# Altium project OpenBMS.PrjPcb (part 1 of 2)
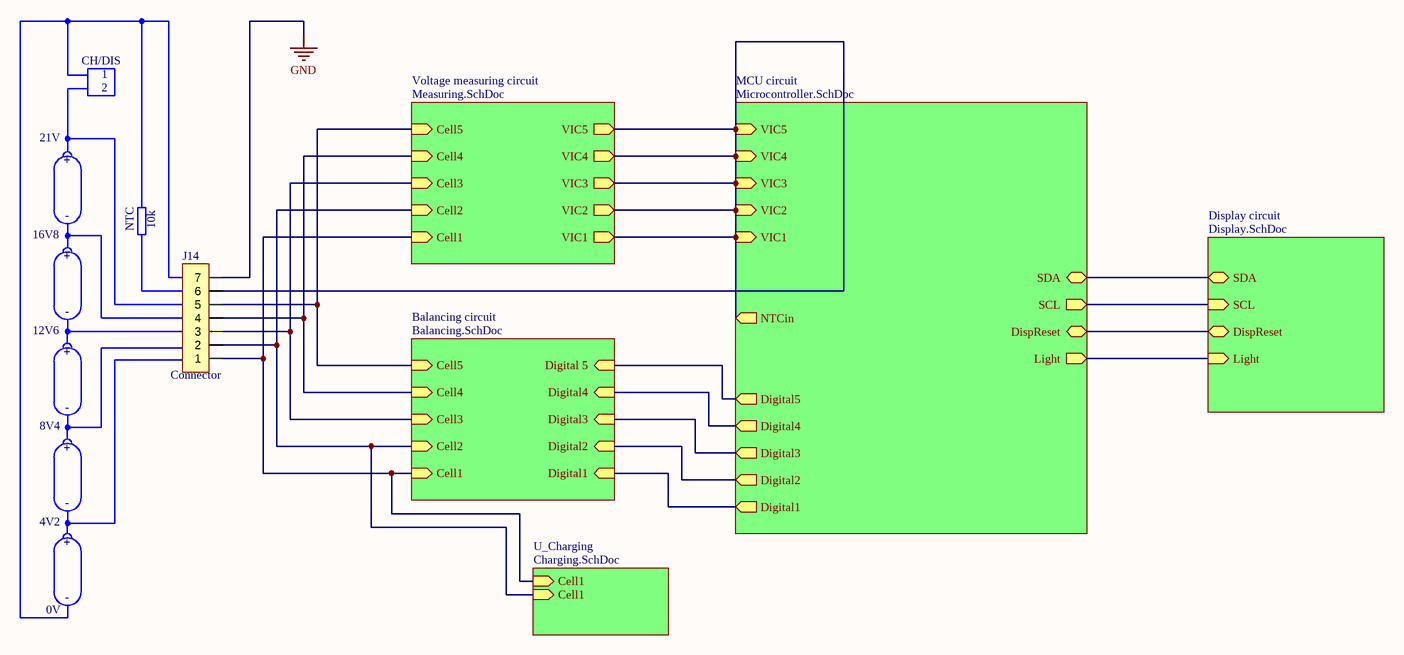
[diagram p0: OpenBMS.SchDoc]
6 sheets, 185 parts. Net scope: hierarchical (ports join the sheet entries above them; power ports are global).
Board file: OpenBMS.PcbDoc
Sheets:
  OpenBMS.SchDoc
    Balancing circuit = Balancing.SchDoc
    Voltage measuring circuit = Measuring.SchDoc
    MCU circuit = Microcontroller.SchDoc
    Display circuit = Display.SchDoc
    U_Charging = Charging.SchDoc

## Sheet OpenBMS.SchDoc: OpenBMS Parent schematic
size 420 x 297 mm; Title2: OpenBMS; Project: OpenBMS; DSN_APP_DATE: --/--/--; CHK_APP_DATE: --/--/--; ApprovedBy: 1; CheckedBy: 1; Author: Kayoum Djedidi; CompanyName: ISIMM; DrawnBy: Kayoum Djedidi; DocumentNumber: 1; Revision: 0; SheetNumber: 1; SheetTotal: 5; ImagePath: 1

### Parts
J14  Name: Connector  [HDR_1x7_2.54mm-MALE]  (hidden comment: Header connector 1x7)

### Sub-sheets
Balancing circuit = Balancing.SchDoc: Cell1 (in), Cell2 (in), Cell3 (in), Cell4 (in), Cell5 (in), Digital 5 (in), Digital4 (in), Digital3 (in), Digital2 (in), Digital1 (in)
Display circuit = Display.SchDoc: Light (in), DispReset (bidir), SCL (in), SDA (bidir)
MCU circuit = Microcontroller.SchDoc: VIC5 (in), VIC4 (in), VIC3 (in), VIC2 (in), VIC1 (in), Digital5 (out), Digital4 (out), Digital3 (out), Digital2 (out), Digital1 (out), SDA (bidir), SCL (out), DispReset (bidir), Light (out), NTCin (out)
U_Charging = Charging.SchDoc: Cell1 (in), Cell1 (in)
Voltage measuring circuit = Measuring.SchDoc: Cell5 (in), Cell4 (in), Cell3 (in), Cell2 (in), Cell1 (in), VIC5 (out), VIC4 (out), VIC3 (out), VIC2 (out), VIC1 (out)

### Nets
GND: J14.7
+21V: J14.5 ; sheet Balancing circuit/Cell5, sheet Voltage measuring circuit/Cell5
NTCin: J14.6 ; sheet Voltage measuring circuit/VIC5, sheet Voltage measuring circuit/VIC4, sheet Voltage measuring circuit/VIC3, sheet Voltage measuring circuit/VIC2, sheet Voltage measuring circuit/VIC1, sheet MCU circuit/VIC5, sheet MCU circuit/VIC4, sheet MCU circuit/VIC3, sheet MCU circuit/VIC2, sheet MCU circuit/VIC1, sheet MCU circuit/NTCin
NetC13_2: J14.1 J14.2 ; sheet Balancing circuit/Cell1, sheet Balancing circuit/Cell2, sheet Voltage measuring circuit/Cell2, sheet Voltage measuring circuit/Cell1, sheet U_Charging/Cell1, sheet U_Charging/Cell1
NetDS1_1: sheet MCU circuit/DispReset, sheet Display circuit/DispReset
NetDS1_2: sheet MCU circuit/SCL, sheet Display circuit/SCL
NetDS1_3: sheet MCU circuit/SDA, sheet Display circuit/SDA
NetJ3_1: J14.3 ; sheet Balancing circuit/Cell3, sheet Voltage measuring circuit/Cell3
NetJ4_1: J14.4 ; sheet Balancing circuit/Cell4, sheet Voltage measuring circuit/Cell4
NetMCU1_5: sheet Balancing circuit/Digital 5, sheet MCU circuit/Digital5
NetMCU1_6: sheet Balancing circuit/Digital4, sheet MCU circuit/Digital4
NetMCU1_7: sheet Balancing circuit/Digital3, sheet MCU circuit/Digital3
NetMCU1_8: sheet Balancing circuit/Digital2, sheet MCU circuit/Digital2
NetMCU1_9: sheet Balancing circuit/Digital1, sheet MCU circuit/Digital1
NetMCU1_13: sheet MCU circuit/Light, sheet Display circuit/Light

### Notes on the sheet
- CH/DIS
- 1
- 21V
- 2
- +
- -
- 16V8
- NTC
- 10k
- 12V6
- 8V4
- 4V2
- 0V
- THIS DOCUMENT AND THE DATA DISCLOSED HEREIN OR
- HEREWITH IS THE PROPERTY OF ALTIUM LIMITED AND MAY
- DWG NO:
- REVISION
- REV:
- DESCRIPTION
- DATE
- APPROVED
- BE FREELY DISTRIBUTED IN WHOLE. NO RIGHTS ARE
- RESERVED OR EXPRESS OR IMPLIED WARANTEE GIVEN.
- ENG:
- APPROVALS
- PROJECT
- DSN:
- CHK:
- REFERENCE DOCUMENTS
- PROJECT REVISION:
- TITLE
- DOCUMENT REVISION:
- DESIGN ITEM:
- BOM:
- FAB DWG:
- PCB DWG:
- ASSY DWG:
- SCALE:
- A3
- SIZE
- CAGE CODE
- FILE NAME
- DWG NO.
- SHEET
- OF
- REV

### Library data of the parts
J14 = Header connector 1x7: Header, 7-Pin [TH]; Manufacturer: Molex; Manufacturer Part Number: 70543-0006; Contact Resistance: 30mR; Current Rating: 3A; Gender: Male; Glow Wire Compliant: Non-compliant; Number of Circuits: 7; Pitch: 2.54mm; Voltage Rating: 250V; LatestRevisionDate: 17-Jul-2002; LatestRevisionNote: Re-released for DXP Platform.; Publisher: Altium Limited; ComponentLink1Description: Male_DATASHEET; ComponentLink1URL: https://hr.mouser.com/datasheet/2/276/1/0705430006_PCB_HEADERS-172671.pdf; ComponentLink2Description: Male_BUY; ComponentLink2URL: https://hr.mouser.com/ProductDetail/Molex/70543-0006?qs=tYx%252BZc2nXqqLGOznLgFBUw%3D%3D; ComponentLink3Description: Female_DATASHEET; ComponentLink3URL: https://hr.mouser.com/datasheet/2/276/0014600072_RB_CBL_WR_TRP_CONN-157136.pdf; ComponentLink4Description: Female_BUY; ComponentLink4URL: https://hr.mouser.com/ProductDetail/Molex/14-60-0072?qs=NB3s7TNnM%252BbcvQdqxWlaYA%3D%3D; Supplier 1: Mouser; Supplier Part Number 1: 538-70543-0006; Color: Black; Contact Material: Bronze,Copper Alloy; Contact Plating: Gold; ELV: Compliant; Flammability Rating: UL94 V-0; Housing Color: Black; Housing Material: Thermoplastic; Lead Free: Lead Free; Material: Brass; Max Operating Temperature: 105°C; Min Operating Temperature: -40°C; Mount: Through Hole; Number of Contacts: 7; Number of Positions: 7; Number of Rows: 1; Orientation: Vertical; Package Quantity: 1248; Packaging: Rail/Tube; Radiation Hardening: No; REACH SVHC: Unknown; RoHS Compliant: Yes; Series: 70543; Termination: Through Hole; Supplier Packaging 1: Tube; Supplier Unit Price 1: $1.68; Supplier Location 1: US

## Sheet Balancing.SchDoc: Cell Balancing
size 420 x 297 mm; ENG_APP_DATE: --/--/--; DSN_APP_DATE: --/--/--; CHK_APP_DATE: --/--/--
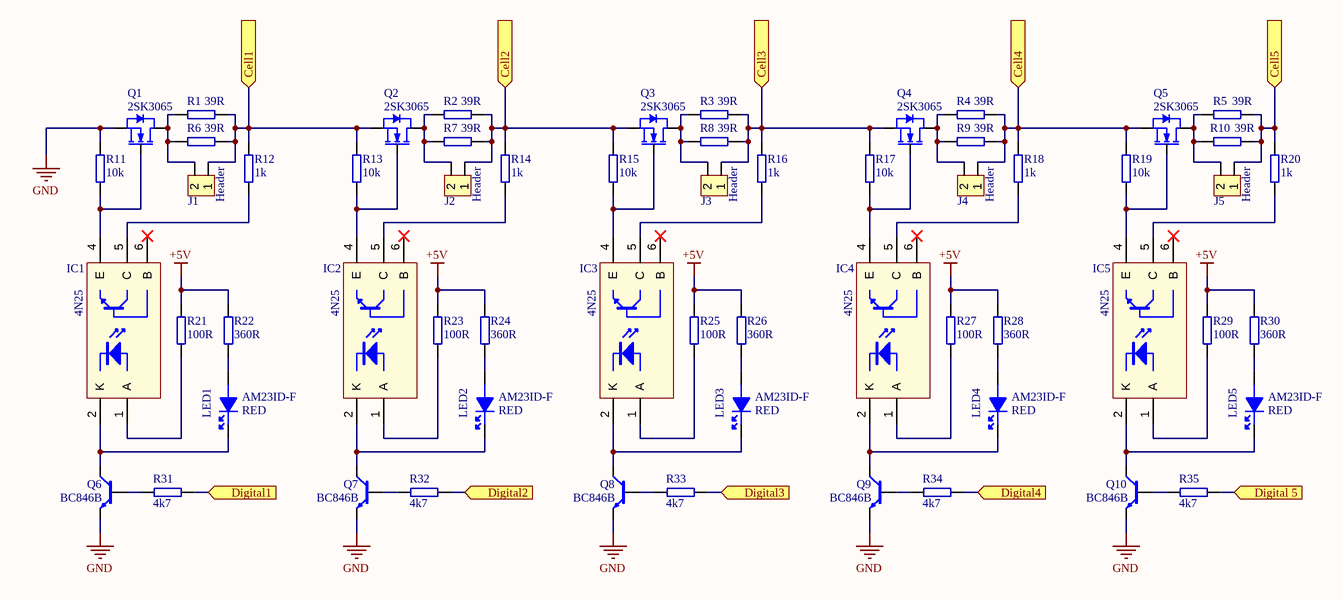
[diagram p1: Balancing.SchDoc]

### Parts
IC1  Manufacturer Part Number: 4N25  [DIP6]  (hidden comment: 4N25_DIP6)
IC2  Manufacturer Part Number: 4N25  [DIP6]  (hidden comment: 4N25_DIP6)
IC3  Manufacturer Part Number: 4N25  [DIP6]  (hidden comment: 4N25_DIP6)
IC4  Manufacturer Part Number: 4N25  [DIP6]  (hidden comment: 4N25_DIP6)
IC5  Manufacturer Part Number: 4N25  [DIP6]  (hidden comment: 4N25_DIP6)
J1  Name: Header  [HDR_1x2_2.54mm-MALE]  (hidden comment: 2.54mm pitch)
J2  Name: Header  [HDR_1x2_2.54mm-MALE]  (hidden comment: 2.54mm pitch)
J3  Name: Header  [HDR_1x2_2.54mm-MALE]  (hidden comment: 2.54mm pitch)
J4  Name: Header  [HDR_1x2_2.54mm-MALE]  (hidden comment: 2.54mm pitch)
J5  Name: Header  [HDR_1x2_2.54mm-MALE]  (hidden comment: 2.54mm pitch)
LED1  Name: RED  Manufacturer Part Number: AM23ID-F  [LED_SOT23]  (hidden comment: LED_SOT23)
LED2  Name: RED  Manufacturer Part Number: AM23ID-F  [LED_SOT23]  (hidden comment: LED_SOT23)
LED3  Name: RED  Manufacturer Part Number: AM23ID-F  [LED_SOT23]  (hidden comment: LED_SOT23)
LED4  Name: RED  Manufacturer Part Number: AM23ID-F  [LED_SOT23]  (hidden comment: LED_SOT23)
LED5  Name: RED  Manufacturer Part Number: AM23ID-F  [LED_SOT23]  (hidden comment: LED_SOT23)
Q1  Name: 2SK3065  [N_MOSFET]  (hidden comment: 2SK3065_SOT89)
Q2  Name: 2SK3065  [N_MOSFET]  (hidden comment: 2SK3065_SOT89)
Q3  Name: 2SK3065  [N_MOSFET]  (hidden comment: 2SK3065_SOT89)
Q4  Name: 2SK3065  [N_MOSFET]  (hidden comment: 2SK3065_SOT89)
Q5  Name: 2SK3065  [N_MOSFET]  (hidden comment: 2SK3065_SOT89)
Q6  Name: BC846B  [NPN_BJT_SOT23]  (hidden comment: BC846B_SOT23)
Q7  Name: BC846B  [NPN_BJT_SOT23]  (hidden comment: BC846B_SOT23)
Q8  Name: BC846B  [NPN_BJT_SOT23]  (hidden comment: BC846B_SOT23)
Q9  Name: BC846B  [NPN_BJT_SOT23]  (hidden comment: BC846B_SOT23)
Q10  Name: BC846B  [NPN_BJT_SOT23]  (hidden comment: BC846B_SOT23)
R1  Name: 39R  [R_2512]  (hidden comment: 39R_2W)
R2  Name: 39R  [R_2512]  (hidden comment: 39R_2W)
R3  Name: 39R  [R_2512]  (hidden comment: 39R_2W)
R4  Name: 39R  [R_2512]  (hidden comment: 39R_2W)
R5  Name: 39R  [R_2512]  (hidden comment: 39R_2W)
R6  Name: 39R  [R_2512]  (hidden comment: 39R_2W)
R7  Name: 39R  [R_2512]  (hidden comment: 39R_2W)
R8  Name: 39R  [R_2512]  (hidden comment: 39R_2W)
R9  Name: 39R  [R_2512]  (hidden comment: 39R_2W)
R10  Name: 39R  [R_2512]  (hidden comment: 39R_2W)
R11  Name: 10k  [R_0805]  (hidden comment: 10k_125mW)
R12  Name: 1k  [R_0805]  (hidden comment: 1k_125mW)
R13  Name: 10k  [R_0805]  (hidden comment: 10k_125mW)
R14  Name: 1k  [R_0805]  (hidden comment: 1k_125mW)
R15  Name: 10k  [R_0805]  (hidden comment: 10k_125mW)
R16  Name: 1k  [R_0805]  (hidden comment: 1k_125mW)
R17  Name: 10k  [R_0805]  (hidden comment: 10k_125mW)
R18  Name: 1k  [R_0805]  (hidden comment: 1k_125mW)
R19  Name: 10k  [R_0805]  (hidden comment: 10k_125mW)
R20  Name: 1k  [R_0805]  (hidden comment: 1k_125mW)
R21  Name: 100R  [R_0805]  (hidden comment: 100R_500mW)
R22  Name: 360R  [R_0805]  (hidden comment: 360R_125mW)
R23  Name: 100R  [R_0805]  (hidden comment: 100R_500mW)
R24  Name: 360R  [R_0805]  (hidden comment: 360R_125mW)
R25  Name: 100R  [R_0805]  (hidden comment: 100R_500mW)
R26  Name: 360R  [R_0805]  (hidden comment: 360R_125mW)
R27  Name: 100R  [R_0805]  (hidden comment: 100R_500mW)
R28  Name: 360R  [R_0805]  (hidden comment: 360R_125mW)
R29  Name: 100R  [R_0805]  (hidden comment: 100R_500mW)
R30  Name: 360R  [R_0805]  (hidden comment: 360R_125mW)
R31  Name: 4k7  [R_0805]  (hidden comment: 4k7_125mW)
R32  Name: 4k7  [R_0805]  (hidden comment: 4k7_125mW)
R33  Name: 4k7  [R_0805]  (hidden comment: 4k7_125mW)
R34  Name: 4k7  [R_0805]  (hidden comment: 4k7_125mW)
R35  Name: 4k7  [R_0805]  (hidden comment: 4k7_125mW)

### Ports
Cell1 (in), Cell2 (in), Cell3 (in), Cell4 (in), Cell5 (in), Digital1 (in), Digital2 (in), Digital3 (in), Digital4 (in), Digital 5 (in)

### Nets
+5V: R21.2 R22.1 R23.1 R24.1 R25.1 R26.1 R27.1 R28.1 R29.1 R30.1
GND: Q1.3(S) Q6.3(E) Q7.3(E) Q8.3(E) Q9.3(E) Q10.3(E) R11.1
+21V: J5.1 R5.1 R10.1 R20.1 ; port Cell5
NetC13_2: J1.1 J2.1 Q2.3(S) Q3.3(S) R1.1 R2.1 R6.1 R7.1 R12.1 R13.1 R14.1 R15.1 ; port Cell1, port Cell2
NetIC1_1: IC1.1(A) R21.1
NetIC1_2: IC1.2(K) LED1.3(K) Q6.1(C)
NetIC1_4: IC1.4(E) Q1.1(G) R11.2
NetIC1_5: IC1.5(C) R12.2
NetIC2_1: IC2.1(A) R23.2
NetIC2_2: IC2.2(K) LED2.3(K) Q7.1(C)
NetIC2_4: IC2.4(E) Q2.1(G) R13.2
NetIC2_5: IC2.5(C) R14.2
NetIC3_1: IC3.1(A) R25.2
NetIC3_2: IC3.2(K) LED3.3(K) Q8.1(C)
NetIC3_4: IC3.4(E) Q3.1(G) R15.2
NetIC3_5: IC3.5(C) R16.2
NetIC4_1: IC4.1(A) R27.2
NetIC4_2: IC4.2(K) LED4.3(K) Q9.1(C)
NetIC4_4: IC4.4(E) Q4.1(G) R17.2
NetIC4_5: IC4.5(C) R18.2
NetIC5_1: IC5.1(A) R29.2
NetIC5_2: IC5.2(K) LED5.3(K) Q10.1(C)
NetIC5_4: IC5.4(E) Q5.1(G) R19.2
NetIC5_5: IC5.5(C) R20.2
NetJ1_2: J1.2 Q1.2(D) R1.2 R6.2
NetJ2_2: J2.2 Q2.2(D) R2.2 R7.2
NetJ3_1: J3.1 Q4.3(S) R3.1 R8.1 R16.1 R17.1 ; port Cell3
NetJ3_2: J3.2 Q3.2(D) R3.2 R8.2
NetJ4_1: J4.1 Q5.3(S) R4.1 R9.1 R18.1 R19.1 ; port Cell4
NetJ4_2: J4.2 Q4.2(D) R4.2 R9.2
NetJ5_2: J5.2 Q5.2(D) R5.2 R10.2
NetLED1_1: LED1.1(A) R22.2
NetLED2_1: LED2.1(A) R24.2
NetLED3_1: LED3.1(A) R26.2
NetLED4_1: LED4.1(A) R28.2
NetLED5_1: LED5.1(A) R30.2
NetMCU1_5: R35.2 ; port Digital 5
NetMCU1_6: R34.1 ; port Digital4
NetMCU1_7: R33.2 ; port Digital3
NetMCU1_8: R32.1 ; port Digital2
NetMCU1_9: R31.1 ; port Digital1
NetQ6_2: Q6.2(B) R31.2
NetQ7_2: Q7.2(B) R32.2
NetQ8_2: Q8.2(B) R33.1
NetQ9_2: Q9.2(B) R34.2
NetQ10_2: Q10.2(B) R35.1

Not connected (* = marked no-connect by the designer): IC1 6(B)*; IC2 6(B)*; IC3 6(B)*; IC4 6(B)*; IC5 6(B)*

### Notes on the sheet
- THIS DOCUMENT AND THE DATA DISCLOSED HEREIN OR
- HEREWITH IS THE PROPERTY OF ALTIUM LIMITED AND MAY
- DWG NO:
- REVISION
- REV:
- DESCRIPTION
- DATE
- APPROVED
- BE FREELY DISTRIBUTED IN WHOLE. NO RIGHTS ARE
- RESERVED OR EXPRESS OR IMPLIED WARANTEE GIVEN.
- ENG:
- APPROVALS
- PROJECT
- DSN:
- CHK:
- REFERENCE DOCUMENTS
- PROJECT REVISION:
- TITLE
- DOCUMENT REVISION:
- DESIGN ITEM:
- BOM:
- FAB DWG:
- PCB DWG:
- ASSY DWG:
- SCALE:
- A3
- SIZE
- CAGE CODE
- FILE NAME
- DWG NO.
- SHEET
- OF
- REV

### Library data of the parts
IC1-IC5 = 4N25_DIP6: Optocoupler [TH]; Manufacturer: Vishay Semiconductors; Max Power Dissipation: 150mW; Number of Elements: 1; Collector Emitter Voltage (VCEO): 30V; Rise Time: 2s; Isolation Voltage: 5kV; Forward Voltage: 1.5V; Forward Current: 60mA; Collector Emitter Saturation Voltage: 500mV; Reverse Breakdown Voltage: 5V; Output Voltage: 70V; Output Current per Channel: 50mA; Max Collector Current: 100mA; Current Transfer Ratio: 50%; Approvals: UL; Supplier 1: Mouser; RoHS: Yes; Mount: Through Hole; Case/Package: DIP-6; Number of Pins: 6; Contact Plating: Tin; Min Operating Temperature: -55°C; Max Operating Temperature: 100°C; Packaging: Rail/Tube; Package Quantity: 2000; Power Dissipation: 150mW; Number of Channels: 1; Max Input Current: 60mA; Max Output Voltage: 30V; Fall Time: 2s; Input Current: 50mA; Collector Emitter Breakdown Voltage: 30V; Radiation Hardening: No; Lead Free: Lead Free; REACH SVHC: Unknown; ComponentLink1URL: https://hr.mouser.com/datasheet/2/427/VISHS81804_1-2566401.pdf; ComponentLink1Description: DATASHEET; ComponentLink3URL: https://hr.mouser.com/ProductDetail/Vishay-Semiconductors/4N25?qs=8Ee2Dc0%2F0IdkAlKrFkNMCA%3D%3D; ComponentLink3Description: BUY; Supplier Part Number 1: 78-4N25
J1-J5 = Header 1x2: Header, 2-Pin [TH]; Manufacturer: Molex; Current Rating: 4A; Gender: Male; Glow Wire Compliant: Non-compliant; Number of Circuits: 15; Pitch: 0.1inch; Voltage Rating: 250V; Connector Type: Male Pin; LatestRevisionDate: 17-Jul-2002; LatestRevisionNote: Re-released for DXP Platform.; Publisher: Altium Limited; ComponentLink1Description: DATASHEET; ComponentLink1URL: https://hr.mouser.com/datasheet/2/276/0022284150_PCB_HEADERS-159054.pdf; ComponentLink2Description: BUY; ComponentLink2URL: https://hr.mouser.com/ProductDetail/Molex/22-28-4150?qs=M5Ic86%252BuP8aClMFgmZrq7g%3D%3D; Supplier 1: Mouser; Supplier Part Number 1: 538-22-28-4150; Color: Black; Contact Material: Brass; Contact Mating Length: 0.24inch; Contact Plating: Tin; Contact Type: Male Pin; Flammability Rating: UL94 V-0; Height: 2.29mm; Housing Color: Black; Housing Material: Thermoplastic; Lead Free: Contains Lead; Length: 38.1mm; Mount: Through Hole; Number of Contacts: 15; Number of Positions: 15; Number of Rows: 1; Orientation: Vertical; Package Quantity: 1; Packaging: Bulk; RoHS Compliant: Yes; Series: KK® 42375; Termination: Solder; Voltage Rating (DC): 250V; Width: 2.49mm; Supplier Packaging 1: Bulk; Supplier Unit Price 1: $0.57; Supplier Location 1: US; Manufacturer Part Number: 22-28-4150
LED1-LED5 = LED_SOT23: Red LED [SMD]; Manufacturer: Kingbright; Dominant Wavelength: 617nm; Forward Current: 20mA; Forward Voltage: 2V; Lens Style: Diffused,Tinted; Lens Transparency: Diffused; Luminous Intensity: 7mcd; Power Rating: 75mW; Viewing Angle: 140°; Wavelength: 625nm; ComponentLink1Description: DATASHEET; ComponentLink1URL: https://hr.mouser.com/datasheet/2/216/AM23ID-F-33364.pdf; ComponentLink2Description: BUY; ComponentLink2URL: https://hr.mouser.com/ProductDetail/Kingbright/AM23ID-F?qs=y3UkhjaxUTbVf8YFp%2FiekA%3D%3D; Supplier 1: Mouser; Supplier Part Number 1: 604-AM23ID-F; Case/Package: SOT-23; Color: Red; Height: 1.2mm; Illumination Color: Red; Lead Free: Lead Free; Length: 3mm; Lens Color: Red; Max Operating Temperature: 85°C; Min Operating Temperature: -40°C; Mount: Surface Mount; Package Quantity: 2000; Packaging: Tape and Reel; RoHS Compliant: Yes; Series: -; Test Current: 20mA; Width: 1.3mm; Supplier Packaging 1: Tape & Reel; Supplier Unit Price 1: $0.50; Supplier Location 1: US
Q1-Q5 = 2SK3065_SOT89: N Channel MOSFET [SMD]; Manufacturer_Part_Number: 2SK3065T100; Manufacturer: Rohm; Vendor: ROHM Semiconductor; Built_By: EMA_Matt; SourceLibrary: Rohm_2019-09-23; Type: DEV; Continuous Drain Current (ID): 2A; Drain to Source Breakdown Voltage: 60V; Drain to Source Resistance: 350mR; Element Configuration: Single; Fall Time: 70ns; Gate to Source Voltage (Vgs): 20V; Input Capacitance: 160pF; Max Power Dissipation: 500mW; Nominal Vgs: 800mV; On-State Resistance: 450mR; Power Dissipation: 2W; Rds On Max: 320mR; Rise Time: 50ns; Turn-Off Delay Time: 120ns; Turn-On Delay Time: 20ns; Copyright: Copyright (C) 2018 Accelerated Designs. All rights reserved; RefDes: RefDes; Value: Value; ComponentLink1Description: DATASHEET; ComponentLink1URL: https://hr.mouser.com/datasheet/2/348/rohm_semiconductor_rohms30086-1-1742632.pdf; ComponentLink2Description: BUY; ComponentLink2URL: https://hr.mouser.com/ProductDetail/ROHM-Semiconductor/2SK3065T100?qs=4kLU8WoGk0uDb4MT5MWZbg%3D%3D; Supplier 1: Mouser; Supplier Part Number 1: 755-2SK3065T100; Case/Package: SOT-89; Current Rating: 2A; Drain to Source Voltage (Vdss): 60V; Lead Free: Lead Free; Max Operating Temperature: 150°C; Min Operating Temperature: -55°C; Mount: Surface Mount; Number of Pins: 3; Package Quantity: 1000; Packaging: Tape and Reel; Radiation Hardening: No; REACH SVHC: No SVHC; RoHS Compliant: Yes; Threshold Voltage: 800mV; Voltage Rating (DC): 60V; Supplier Packaging 1: Tape & Reel; Supplier Unit Price 1: $0.68; Supplier Location 1: US; Manufacturer Part Number: 2SK3065T100
Q6-Q10 = BC846B_SOT23: NPN transistor [SMD]; Manufacturer Part Number: BC846ALT1G; Manufacturer: ON Semiconductor; Collector Base Voltage (VCBO): 80V; Collector Emitter Breakdown Voltage: 65V; Collector Emitter Saturation Voltage: 600mV; Current Rating: 100mA; Element Configuration: Single; Emitter Base Voltage (VEBO): 6V; Frequency: 100MHz; hFE Min: 110; Max Power Dissipation: 300mW; Number of Elements: 1; ComponentLink1Description: DATASHEET; ComponentLink1URL: https://hr.mouser.com/datasheet/2/308/1/BC846ALT1_D-2310268.pdf; ComponentLink2Description: BUY; ComponentLink2URL: https://hr.mouser.com/ProductDetail/onsemi/BC846ALT1G?qs=vNc2DXHODiKaYXYnVvJi5w%3D%3D; Case/Package: SOT-23; Collector Emitter Voltage (VCEO): 65V; Collector-emitter Voltage-Max: 600mV; Contact Plating: Tin,Matte; Gain Bandwidth Product: 100MHz; Halogen Free: Halogen Free; Height: 0.94mm; Lead Free: Lead Free; Length: 2.9mm; Max Breakdown Voltage: 65V; Max Collector Current: 100mA; Max Frequency: 100MHz; Max Operating Temperature: 150°C; Min Operating Temperature: -55°C; Number of Pins: 3; Package Quantity: 1; Packaging: Tape and Reel; Polarity: NPN; Power Dissipation: 300mW; Radiation Hardening: No; REACH SVHC: No SVHC; RoHS Compliant: Yes; Series: BC846AL; Transition Frequency: 100MHz; Voltage Rating (DC): 65V; Width: 1.3mm; Supplier 1: Mouser; Supplier Part Number 1: 863-BC846ALT1G
R1-R10 = R_39R_2512: Resistor [SMD]; Manufacturer: TE Connectivity; Manufacturer Part Number: CRGP2512F39R; Max Power Dissipation: 2W; Temperature Coefficient: 200ppm/°C; Tolerance: 1%; ComponentLink1Description: DATASHEET; ComponentLink1URL: https://hr.mouser.com/datasheet/2/418/8/ENG_DS_9_1773463_9_B-1358566.pdf; ComponentLink2Description: BUY; ComponentLink2URL: https://hr.mouser.com/ProductDetail/TE-Connectivity-Holsworthy/CRGP2512F39R?qs=sGAEpiMZZMtlubZbdhIBIOInyB5Ysv8sHnBniE7kULc%3D; Supplier 1: Mouser; Supplier Part Number 1: 279-CRGP2512F39R; Case/Package: 2512; Max Operating Temperature: 155°C; Min Operating Temperature: -55°C; Number of Terminations: 2; Packaging: Cut Tape; Resistance: 39R; Resistor Type: Thick Film; RoHS Compliant: Yes; Supplier Unit Price 1: $0.57; Supplier Location 1: US
R11 R13 R15 R17 R19 = R_10k_0805: Resistor [SMD]; Manufacturer: Vishay; Manufacturer Part Number: CRCW080510K0FKEAC; Power Rating: 125mW; Resistance: 10000R; Tolerance: 1%; ComponentLink1Description: DATASHEET; ComponentLink1URL: https://hr.mouser.com/datasheet/2/427/crcwce3-1762584.pdf; ComponentLink2Description: BUY; ComponentLink2URL: https://hr.mouser.com/ProductDetail/Vishay-Dale/CRCW080510K0FKEAC?qs=E3Y5ESvWgWORadmUijPtxQ%3D%3D; Supplier 1: Mouser; Supplier Part Number 1: 71-CRCW080510K0FKEAC; Case/Package: 0805; Lead Free: Lead Free; RoHS Compliant: Yes; Supplier Packaging 1: Tape & Reel; Supplier Unit Price 1: $0.10; Supplier Location 1: US
R12 R14 R16 R18 R20 = R_1k_0805: Resistor [SMD]; Manufacturer: Vishay; Manufacturer Part Number: CRCW08051K00FKEAC; Max Power Dissipation: 125mW; Resistance: 1kR; Temperature Coefficient: 100ppm/°C; Tolerance: 1%; Voltage Rating: 150V; ComponentLink1Description: DATASHEET; ComponentLink1URL: https://www.mouser.com/datasheet/2/427/crcwce3-1762584.pdf; ComponentLink2Description: BUY; ComponentLink2URL: https://www.mouser.com/ProductDetail/Vishay-Dale/CRCW08051K00FKEAC?qs=CZ6xfwOSLTXmQIgaYvN%2FBA%3D%3D; Supplier 1: Mouser; Supplier Part Number 1: 71-CRCW08051K00FKEAC; Case Code (Imperial): 0805; Case Code (Metric): 2012; Case/Package: 0805; Contact Plating: Tin; Features: Automotive AEC-Q200,Anti-Sulfur; Height: 0.02inch; Length: 2mm; Max Operating Temperature: 155°C; Min Operating Temperature: -55°C; Number of Terminations: 2; Package Quantity: 5000; Packaging: Tape and Reel; Power Rating: 125mW; Radiation Hardening: No; Resistor Type: Thick Film; RoHS Compliant: Yes; Series: RCA; Termination: Wraparound; Width: 0.049inch; Supplier Packaging 1: Tape & Reel; Supplier Unit Price 1: $0.12; Supplier Location 1: US; Lead Free: Lead Free; Mount: Surface Mount
R21 R23 R25 R27 R29 = R_100R_0805: Resistor [SMD]; Manufacturer: Vishay Dale; Manufacturer Part Number: CRCW0805100RFKEAHP; Max Power Dissipation: 500mW; Power Rating: 330mW; Resistance Tolerance: 1%; Temperature Coefficient: 100ppm/°C; Voltage Rating: 150V; ComponentLink1Description: DATASHEET; ComponentLink1URL: https://hr.mouser.com/datasheet/2/427/crcwhpe3-1713858.pdf; ComponentLink2Description: BUY; ComponentLink2URL: https://hr.mouser.com/ProductDetail/Vishay-Dale/CRCW0805100RFKEAHP?qs=sGAEpiMZZMtlubZbdhIBIB2QTI7Ai3WqiihO7cZ%2FwYw%3D; Supplier 1: Mouser; Supplier Part Number 1: 71-CRCW0805100RFKEAH; Case Code (Imperial): 0805; Case Code (Metric): 2012; Case/Package: 0805; Construction: Rectangular; Contact Plating: Tin; Depth: 1.25mm; Features: Automotive AEC-Q200; Height: 0.5mm; Lead Free: Lead Free; Length: 2mm; Max Operating Temperature: 155°C; Military Standard: Not; Min Operating Temperature: -55°C; Mount: Surface Mount; Number of Terminations: 2; Package Quantity: 5000; Packaging: Tape and Reel; Radiation Hardening: No; REACH SVHC: Unknown; Resistance: 100R; Resistor Type: Thick Film; RoHS Compliant: Yes; Series: CRCW-HP; Technology: THICK FILM; Termination: SMD/SMT; Tolerance: 1%; Voltage Rating (DC): 150V; Weight: 0.000194oz; Width: 1.2mm
R22 R24 R26 R28 R30 = R_360R_0805: Resistor [SMD]; Manufacturer: Vishay; Manufacturer Part Number: CRCW0805360RFKEA; Max Power Dissipation: 125mW; Number of Terminals/Pins: 2; Temperature Coefficient: 100ppm/°C; Tolerance: 1%; Voltage Rating: 150V; ComponentLink1Description: DATASHEET; ComponentLink1URL: https://hr.mouser.com/datasheet/2/427/dcrcwe3-1762152.pdf; ComponentLink2Description: BUY; ComponentLink2URL: https://hr.mouser.com/ProductDetail/Vishay-Dale/CRCW0805360RFKEA?qs=ofC1ORbyWJdnf1jRDhIDIw%3D%3D; Supplier 1: Mouser; Supplier Part Number 1: 71-CRCW0805360RFKEA; Case Code (Imperial): 0805; Case Code (Metric): 2012; Case/Package: 0805; Contact Plating: Tin; Depth: 1.25mm; Features: Automotive AEC-Q200; Height: 0.45mm; Lead Free: Lead Free; Length: 2mm; Max Operating Temperature: 155°C; Military Standard: Not; Min Operating Temperature: -55°C; Number of Pins: 2; Number of Terminations: 2; Package Quantity: 5000; Packaging: Cut Tape; Power Rating: 125mW; Radiation Hardening: No; REACH SVHC: Unknown; Resistance: 360R; Resistor Type: Thick Film; RoHS Compliant: Yes; Series: D/CRCW E3; Technology: THICK FILM; Termination: SMD/SMT; Voltage Rating (DC): 150V; Weight: 0.000194oz; Width: 1.25mm; Supplier Packaging 1: Tape & Reel; Supplier Unit Price 1: $0.12; Supplier Location 1: US
R31-R35 = R_4k7_0805: Resistor [SMD]; Manufacturer: Vishay; Manufacturer Part Number: CRCW08054K70FKEAC; Power Rating: 125mW; Resistance: 4.7kR; Tolerance: 1%; Temperature Coefficient: 100ppm/°C; ComponentLink1Description: DATASHEET; ComponentLink1URL: https://www.mouser.com/datasheet/2/427/crcwce3-1762584.pdf; ComponentLink2Description: BUY; ComponentLink2URL: https://www.mouser.com/ProductDetail/Vishay-Dale/CRCW08054K70FKEAC?qs=E3Y5ESvWgWOQAAVugewEHA%3D%3D; Case/Package: 0805; Lead Free: Lead Free; RoHS Compliant: Yes; Contact Plating: Tin; Length: 2mm; Max Operating Temperature: 155°C; Min Operating Temperature: -55°C; Mount: Surface Mount; Resistor Type: Thick Film; Termination: Wraparound; Supplier Part Number 1: 71-CRCW08054K70FKEAC; Supplier 1: Mouser

## Sheet Measuring.SchDoc: Voltage Measurer
size 420 x 297 mm; ENG_APP_DATE: --/--/--; DSN_APP_DATE: --/--/--; CHK_APP_DATE: --/--/--; Revision: Cell Balancing
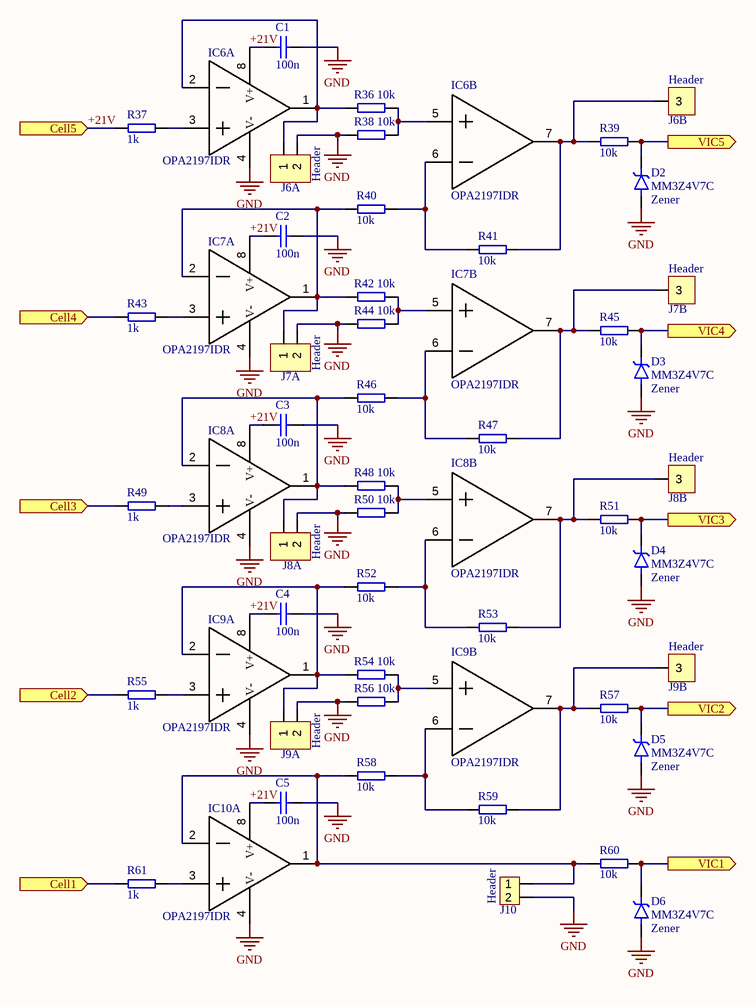
[diagram p2: Measuring.SchDoc]

### Parts
C1  Name: 100n  [C_0805]  (hidden comment: 100nF_35V)
C2  Name: 100n  [C_0805]  (hidden comment: 100nF_35V)
C3  Name: 100n  [C_0805]  (hidden comment: 100nF_35V)
C4  Name: 100n  [C_0805]  (hidden comment: 100nF_35V)
C5  Name: 100n  [C_0805]  (hidden comment: 100nF_35V)
D2  value MM3Z4V7C  Type: Zener  [SODFL2512X90N]  (hidden comment: MM3Z4V7C_SOD-323F)
D3  value MM3Z4V7C  Type: Zener  [SODFL2512X90N]  (hidden comment: MM3Z4V7C_SOD-323F)
D4  value MM3Z4V7C  Type: Zener  [SODFL2512X90N]  (hidden comment: MM3Z4V7C_SOD-323F)
D5  value MM3Z4V7C  Type: Zener  [SODFL2512X90N]  (hidden comment: MM3Z4V7C_SOD-323F)
D6  value MM3Z4V7C  Type: Zener  [SODFL2512X90N]  (hidden comment: MM3Z4V7C_SOD-323F)
IC6  Manufacturer_Part_Number: OPA2197IDR  [SOIC8]  (hidden comment: OPA2197IDR_8-SOIC)  (parts A,B of 2)
IC7  Manufacturer_Part_Number: OPA2197IDR  [SOIC8]  (hidden comment: OPA2197IDR_8-SOIC)  (parts A,B of 2)
IC8  Manufacturer_Part_Number: OPA2197IDR  [SOIC8]  (hidden comment: OPA2197IDR_8-SOIC)  (parts A,B of 2)
IC9  Manufacturer_Part_Number: OPA2197IDR  [SOIC8]  (hidden comment: OPA2197IDR_8-SOIC)  (parts A,B of 2)
IC10  Manufacturer_Part_Number: OPA2197IDR  [SOIC8]  (hidden comment: OPA2197IDR_8-SOIC)  (part A of 2)
J6  Name: Header  [HDR_1X3_2.54mm-MALE]  (hidden comment: 2.54mm pitch)  (parts A,B of 2)
J7  Name: Header  [HDR_1X3_2.54mm-MALE]  (hidden comment: 2.54mm pitch)  (parts A,B of 2)
J8  Name: Header  [HDR_1X3_2.54mm-MALE]  (hidden comment: 2.54mm pitch)  (parts A,B of 2)
J9  Name: Header  [HDR_1X3_2.54mm-MALE]  (hidden comment: 2.54mm pitch)  (parts A,B of 2)
J10  Name: Header  [HDR_1x2_2.54mm-MALE]  (hidden comment: 2.54mm pitch)
R36  Name: 10k  [R_0805]  (hidden comment: 10k_125mW)
R37  Name: 1k  [R_0805]  (hidden comment: 1k_125mW)
R38  Name: 10k  [R_0805]  (hidden comment: 10k_125mW)
R39  Name: 10k  [R_0805]  (hidden comment: 10k_125mW)
R40  Name: 10k  [R_0805]  (hidden comment: 10k_125mW)
R41  Name: 10k  [R_0805]  (hidden comment: 10k_125mW)
R42  Name: 10k  [R_0805]  (hidden comment: 10k_125mW)
R43  Name: 1k  [R_0805]  (hidden comment: 1k_125mW)
R44  Name: 10k  [R_0805]  (hidden comment: 10k_125mW)
R45  Name: 10k  [R_0805]  (hidden comment: 10k_125mW)
R46  Name: 10k  [R_0805]  (hidden comment: 10k_125mW)
R47  Name: 10k  [R_0805]  (hidden comment: 10k_125mW)
R48  Name: 10k  [R_0805]  (hidden comment: 10k_125mW)
R49  Name: 1k  [R_0805]  (hidden comment: 1k_125mW)
R50  Name: 10k  [R_0805]  (hidden comment: 10k_125mW)
R51  Name: 10k  [R_0805]  (hidden comment: 10k_125mW)
R52  Name: 10k  [R_0805]  (hidden comment: 10k_125mW)
R53  Name: 10k  [R_0805]  (hidden comment: 10k_125mW)
R54  Name: 10k  [R_0805]  (hidden comment: 10k_125mW)
R55  Name: 1k  [R_0805]  (hidden comment: 1k_125mW)
R56  Name: 10k  [R_0805]  (hidden comment: 10k_125mW)
R57  Name: 10k  [R_0805]  (hidden comment: 10k_125mW)
R58  Name: 10k  [R_0805]  (hidden comment: 10k_125mW)
R59  Name: 10k  [R_0805]  (hidden comment: 10k_125mW)
R60  Name: 10k  [R_0805]  (hidden comment: 10k_125mW)
R61  Name: 1k  [R_0805]  (hidden comment: 1k_125mW)

### Ports
Cell1 (in), Cell2 (in), Cell3 (in), Cell4 (in), Cell5 (in), VIC1 (out), VIC2 (out), VIC3 (out), VIC4 (out), VIC5 (out)

### Nets
GND: C1.1 C2.1 C3.1 C4.1 C5.1 D2.A D3.A D4.A D5.A D6.A IC6.4(V-) IC7.4(V-) IC8.4(V-) IC9.4(V-) IC10.4(V-) J6.2 J7.2 J8.2 J9.2 J10.2 R38.2 R44.2 R50.2 R56.2
+21V: C1.2 C2.2 C3.2 C4.2 C5.2 IC6.8(V+) IC7.8(V+) IC8.8(V+) IC9.8(V+) IC10.8(V+) R37.2 ; port Cell5
NTCin: D2.K D3.K D4.K D5.K D6.K R39.1 R45.1 R51.1 R57.1 R60.1 ; port VIC1, port VIC2, port VIC3, port VIC4, port VIC5
NetC13_2: R55.2 R61.2 ; port Cell2, port Cell1
NetIC6_1: IC6.1(OUT_A) IC6.2(-IN_A) J6.1 R36.2
NetIC6_3: IC6.3(+IN_A) R37.1
NetIC6_5: IC6.5(+IN_B) R36.1 R38.1
NetIC6_6: IC6.6(-IN_B) R40.1 R41.2
NetIC6_7: IC6.7(OUT_B) J6.3 R39.2 R41.1
NetIC7_1: IC7.1(OUT_A) IC7.2(-IN_A) J7.1 R40.2 R42.2
NetIC7_3: IC7.3(+IN_A) R43.1
NetIC7_5: IC7.5(+IN_B) R42.1 R44.1
NetIC7_6: IC7.6(-IN_B) R46.1 R47.2
NetIC7_7: IC7.7(OUT_B) J7.3 R45.2 R47.1
NetIC8_1: IC8.1(OUT_A) IC8.2(-IN_A) J8.1 R46.2 R48.2
NetIC8_3: IC8.3(+IN_A) R49.1
NetIC8_5: IC8.5(+IN_B) R48.1 R50.1
NetIC8_6: IC8.6(-IN_B) R52.1 R53.2
NetIC8_7: IC8.7(OUT_B) J8.3 R51.2 R53.1
NetIC9_1: IC9.1(OUT_A) IC9.2(-IN_A) J9.1 R52.2 R54.2
NetIC9_3: IC9.3(+IN_A) R55.1
NetIC9_5: IC9.5(+IN_B) R54.1 R56.1
NetIC9_6: IC9.6(-IN_B) R58.1 R59.2
NetIC9_7: IC9.7(OUT_B) J9.3 R57.2 R59.1
NetIC10_1: IC10.1(OUT_A) IC10.2(-IN_A) J10.1 R58.2 R60.2
NetIC10_3: IC10.3(+IN_A) R61.1
NetJ3_1: R49.2 ; port Cell3
NetJ4_1: R43.2 ; port Cell4

### Notes on the sheet
- THIS DOCUMENT AND THE DATA DISCLOSED HEREIN OR
- HEREWITH IS THE PROPERTY OF ALTIUM LIMITED AND MAY
- DWG NO:
- REVISION
- REV:
- DESCRIPTION
- DATE
- APPROVED
- BE FREELY DISTRIBUTED IN WHOLE. NO RIGHTS ARE
- RESERVED OR EXPRESS OR IMPLIED WARANTEE GIVEN.
- ENG:
- APPROVALS
- PROJECT
- DSN:
- CHK:
- REFERENCE DOCUMENTS
- PROJECT REVISION:
- TITLE
- DOCUMENT REVISION:
- DESIGN ITEM:
- BOM:
- FAB DWG:
- PCB DWG:
- ASSY DWG:
- SCALE:
- A3
- SIZE
- CAGE CODE
- FILE NAME
- DWG NO.
- SHEET
- OF
- REV

### Library data of the parts
C1-C5 = C_100nF_0805: Capacitor [SMD]; Manufacturer: Murata; Manufacturer Part Number: GCJ21BL81H104KA01L; Capacitance: 100nF; Tolerance: 10%; Voltage Rating: 50V; ComponentLink1Description: DATASHEET; ComponentLink1URL: https://hr.mouser.com/datasheet/2/281/GCJ21BL81H104KA01_01-1963909.pdf; ComponentLink2Description: BUY; ComponentLink2URL: https://hr.mouser.com/ProductDetail/Murata-Electronics/GCJ21BL81H104KA01L?qs=QzBtWTOodeX5ICEuC%252Bh33g%3D%3D; Supplier 1: Mouser; Supplier Part Number 1: 81-GCJ21BL81H104KA1L; Case Code (Imperial): 0805; Case Code (Metric): 2012; Case/Package: 0805; Features: Soft Termination; Max Operating Temperature: 150°C; Min Operating Temperature: -55°C; Mount: Surface Mount; Packaging: Tape and Reel; Ratings: AEC-Q200; RoHS Compliant: Yes; Supplier Packaging 1: Tape & Reel; Supplier Unit Price 1: $0.30; Supplier Location 1: US
D2-D6 = MM3Z4V7C_SOD-323F: Zener Single Diode, 4.7 V, 200 mW [SMD]; Manufacturer: ON Semiconductor / Fairchild; MP: 1N4148WS; MF: ON Semiconductor; Forward Voltage: 1V; Impedance: 75R; Max Power Dissipation: 200mW; Max Reverse Current: 2.7uA; Test Current: 5mA; Tolerance: 5%; Working Voltage: 4.7V; Price: None; SnapEDA_Link: https://www.snapeda.com/parts/1N4148WS/ON%20Semiconductor/view-part/2747266/?ref=snap; Availability: Good; Package: SOD-323FL-2 ON Semiconductor; ComponentLink1Description: DATASHEET; ComponentLink1URL: https://hr.mouser.com/datasheet/2/308/1/MM3Z9V1C_D-2315854.pdf; ComponentLink2Description: BUY; ComponentLink2URL: https://hr.mouser.com/ProductDetail/onsemi-Fairchild/MM3Z4V7C?qs=sGAEpiMZZMtdo5lL%2F%252BX2BwKAOpX0rFyD; Check_prices: https://www.snapeda.com/parts/1N4148WS/ON%20Semiconductor/view-part/2747266/?ref=eda; Purchase-URL: https://pricing.snapeda.com/search/part/1N4148WS/?ref=eda; Supplier 1: Mouser; Supplier Part Number 1: 512-MM3Z4V7C; Element Configuration: Single; Height: 1mm; Lead Free: Lead Free; Length: 1.3mm; Max Operating Temperature: 150°C; Max Reverse Leakage Current: 2.7uA; Min Operating Temperature: -65°C; Mount: Surface Mount; Number of Pins: 2; Package Quantity: 1; Packaging: Tape and Reel; Power Dissipation: 200mW; Radiation Hardening: No; RoHS Compliant: Yes; Voltage Tolerance: 5%; Weight: 0.0276g; Width: 1.7mm; Zener Voltage: 4.7V; Supplier Packaging 1: Tape & Reel; Supplier Unit Price 1: $0.24; Supplier Location 1: US; Manufacturer Part Number: MM3Z4V7C; Case/Package: SOD−323FL
IC6-IC10 = OPA2197IDR_8-SOIC: Dual OP AMP [TH]; Manufacturer_Name: Texas Instruments; Bandwidth: 10MHz; Input Bias Current: 5pA; Input Offset Voltage (Vos): 250uV; Number of Amplifiers: 2; Operating Supply Current: 1mA; Output Current per Channel: 65mA; Slew Rate: 20V/µs; Datasheet Link: https://componentsearchengine.com/Datasheets/2/OPA2197IDR.pdf; Height: 1.75mm; Mouser Part Number: 595-OPA2197IDR; Mouser Price/Stock: https://www.mouser.com/Search/Refine.aspx?Keyword=595-OPA2197IDR; ComponentLink1Description: DATASHEET; ComponentLink1URL: https://www.ti.com/lit/ds/symlink/opa2197.pdf?HQS=dis-mous-null-mousermode-dsf-pf-null-wwe&ts=1646121857740&ref_url=https%253A%252F%252Fwww.mouser.de%252F; ComponentLink2Description: BUY; ComponentLink2URL: https://hr.mouser.com/ProductDetail/Texas-Instruments/OPA2197IDR?qs=LuYMPh7GGMTV7Fo%252BZRgbTw%3D%3D; Supplier 1: Mouser; Supplier Part Number 1: 595-OPA2197IDR; Case/Package: SOIC-8; Gain Bandwidth Product: 10MHz; Lead Free: Lead Free; Max Operating Temperature: 125°C; Min Operating Temperature: -40°C; Mount: Surface Mount; Number of Channels: 2; Number of Circuits: 2; Number of Pins: 8; Packaging: Cut Tape; REACH SVHC: No SVHC; RoHS Compliant: Yes; Supplier Packaging 1: Tape & Reel; Supplier Unit Price 1: $2.72; Supplier Location 1: US; Manufacturer: Texas Instruments; Manufacturer Part Number: OPA2197IDR
J6-J9 = Header 1x3AB: Header, 3-Pin [TH]; Manufacturer: Molex; Connector Type: Male Pin; Current Rating: 4A; Gender: Male; Glow Wire Compliant: Non-compliant; Number of Circuits: 15; Pitch: 0.1inch; Voltage Rating: 250V; LatestRevisionDate: 17-Jul-2002; LatestRevisionNote: Re-released for DXP Platform.; Publisher: Altium Limited; ComponentLink1Description: DATASHEET; ComponentLink1URL: https://hr.mouser.com/datasheet/2/276/0022284150_PCB_HEADERS-159054.pdf; ComponentLink2Description: BUY; ComponentLink2URL: https://hr.mouser.com/ProductDetail/Molex/22-28-4150?qs=M5Ic86%252BuP8aClMFgmZrq7g%3D%3D; Supplier 1: Mouser; Supplier Part Number 1: 538-22-28-4150; Color: Black; Contact Material: Brass; Contact Mating Length: 0.24inch; Contact Plating: Tin; Contact Type: Male Pin; Flammability Rating: UL94 V-0; Height: 2.29mm; Housing Color: Black; Housing Material: Thermoplastic; Lead Free: Contains Lead; Length: 38.1mm; Mount: Through Hole; Number of Contacts: 15; Number of Positions: 15; Number of Rows: 1; Orientation: Vertical; Package Quantity: 1; Packaging: Bulk; RoHS Compliant: Yes; Series: KK® 42375; Termination: Solder; Voltage Rating (DC): 250V; Width: 2.49mm; Supplier Packaging 1: Bulk; Supplier Unit Price 1: $0.57; Supplier Location 1: US; Manufacturer Part Number: 22-28-4150
J10 = Header 1x2: as J1 on sheet Balancing; LatestRevisionDate: 17-Jul-2002; LatestRevisionNote: Re-released for DXP Platform.; Publisher: Altium Limited; ComponentLink1Description: DATASHEET; ComponentLink1URL: https://hr.mouser.com/datasheet/2/276/0022284150_PCB_HEADERS-159054.pdf; ComponentLink2Description: BUY; ComponentLink2URL: https://hr.mouser.com/ProductDetail/Molex/22-28-4150?qs=M5Ic86%252BuP8aClMFgmZrq7g%3D%3D; Supplier 1: Mouser; Supplier Part Number 1: 538-22-28-4150; Color: Black; Contact Material: Brass; Contact Mating Length: 0.24inch; Contact Plating: Tin; Contact Type: Male Pin; Flammability Rating: UL94 V-0; Height: 2.29mm; Housing Color: Black; Housing Material: Thermoplastic; Lead Free: Contains Lead; Length: 38.1mm; Mount: Through Hole; Number of Contacts: 15; Number of Positions: 15; Number of Rows: 1; Orientation: Vertical; Package Quantity: 1; Packaging: Bulk; RoHS Compliant: Yes; Series: KK® 42375; Termination: Solder; Voltage Rating (DC): 250V; Width: 2.49mm; Supplier Packaging 1: Bulk; Supplier Unit Price 1: $0.57; Supplier Location 1: US; Manufacturer Part Number: 22-28-4150
R36 R38-R42 R44-R48 R50-R54 R56-R60 = R_10k_0805: as R11 on sheet Balancing; ComponentLink1Description: DATASHEET; ComponentLink1URL: https://hr.mouser.com/datasheet/2/427/crcwce3-1762584.pdf; ComponentLink2Description: BUY; ComponentLink2URL: https://hr.mouser.com/ProductDetail/Vishay-Dale/CRCW080510K0FKEAC?qs=E3Y5ESvWgWORadmUijPtxQ%3D%3D; Supplier 1: Mouser; Supplier Part Number 1: 71-CRCW080510K0FKEAC; Case/Package: 0805; Lead Free: Lead Free; RoHS Compliant: Yes; Supplier Packaging 1: Tape & Reel; Supplier Unit Price 1: $0.10; Supplier Location 1: US
R37 R43 R49 R55 R61 = R_1k_0805: as R12 on sheet Balancing; ComponentLink1Description: DATASHEET; ComponentLink1URL: https://www.mouser.com/datasheet/2/427/crcwce3-1762584.pdf; ComponentLink2Description: BUY; ComponentLink2URL: https://www.mouser.com/ProductDetail/Vishay-Dale/CRCW08051K00FKEAC?qs=CZ6xfwOSLTXmQIgaYvN%2FBA%3D%3D; Supplier 1: Mouser; Supplier Part Number 1: 71-CRCW08051K00FKEAC; Case Code (Imperial): 0805; Case Code (Metric): 2012; Case/Package: 0805; Contact Plating: Tin; Features: Automotive AEC-Q200,Anti-Sulfur; Height: 0.02inch; Length: 2mm; Max Operating Temperature: 155°C; Min Operating Temperature: -55°C; Number of Terminations: 2; Package Quantity: 5000; Packaging: Tape and Reel; Power Rating: 125mW; Radiation Hardening: No; Resistor Type: Thick Film; RoHS Compliant: Yes; Series: RCA; Termination: Wraparound; Width: 0.049inch; Supplier Packaging 1: Tape & Reel; Supplier Unit Price 1: $0.12; Supplier Location 1: US; Lead Free: Lead Free; Mount: Surface Mount